# Altium schematic sheet Headers.SchDoc: Headers
size A3; DrawnBy: Hassan Alhujhoj, Abdullah Naeem; Address1: ECE Department; Address2: University of Canterbury; Address3: Christchurch 8041; Address4: New Zealand
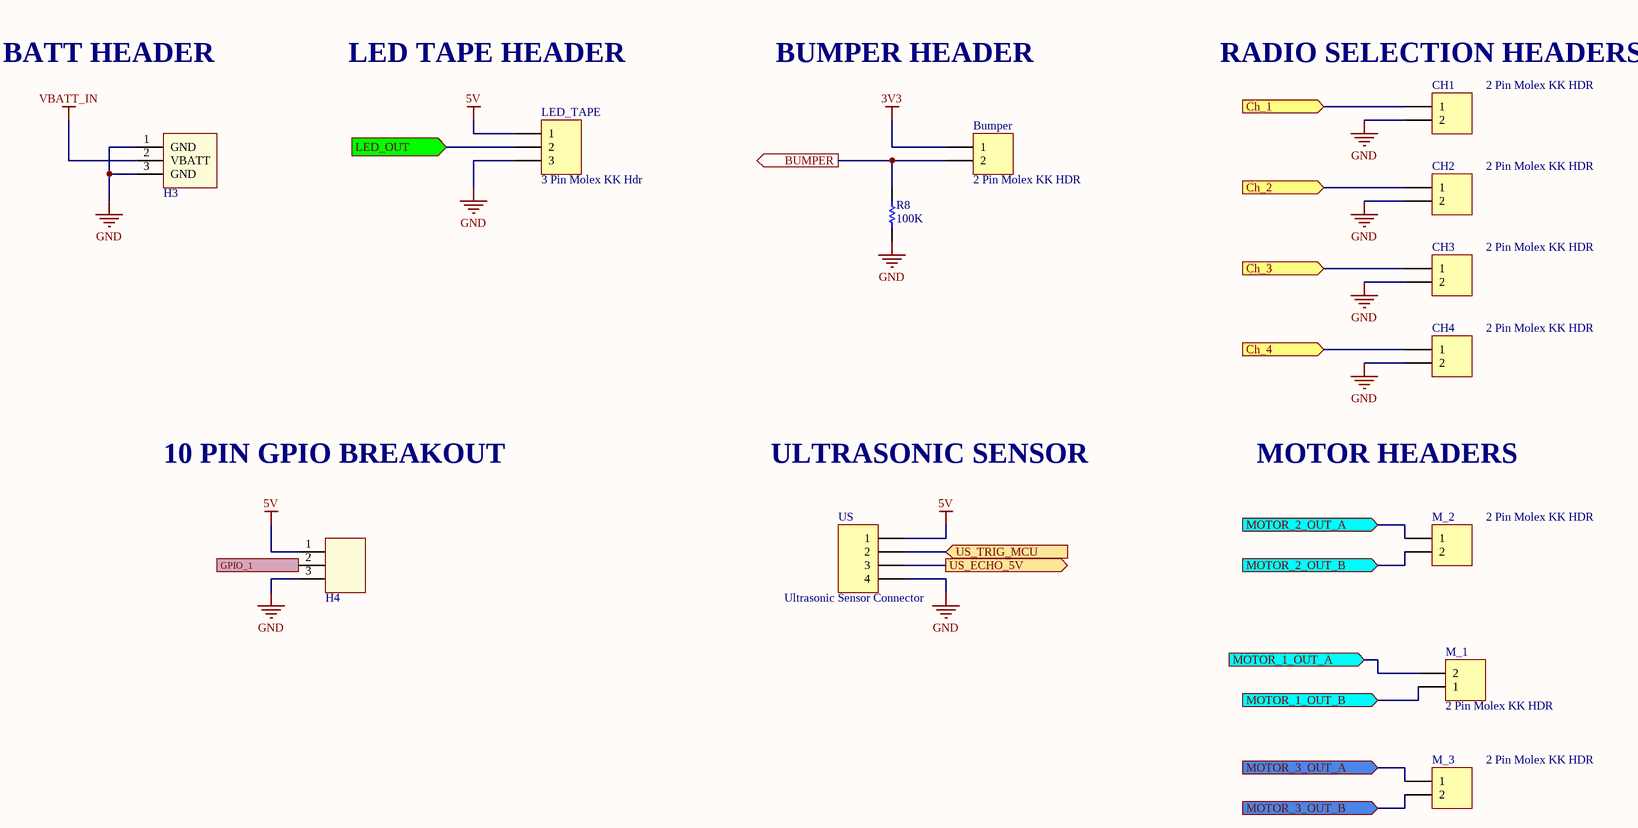
[diagram p0: Headers.SchDoc]

## Parts
Bumper  2 Pin Molex KK HDR  [MOLEX_KK_2_HDR]
CH1  2 Pin Molex KK HDR  [MOLEX_KK_2_HDR]
CH2  2 Pin Molex KK HDR  [MOLEX_KK_2_HDR]
CH3  2 Pin Molex KK HDR  [MOLEX_KK_2_HDR]
CH4  2 Pin Molex KK HDR  [MOLEX_KK_2_HDR]
H3  Battery_HEADER_3pin  [BATT_HEADER_3POS]  (value not drawn)
H4  HEADER_3  [HEADER_3POS]  (value not drawn)
LED_TAPE  3 Pin Molex KK Hdr  [MOLEX_KK_3_HDR]
M_1  2 Pin Molex KK HDR  [MOLEX_KK_2_HDR]
M_2  2 Pin Molex KK HDR  [MOLEX_KK_2_HDR]
M_3  2 Pin Molex KK HDR  [MOLEX_KK_2_HDR]
R8  100K  [RESC1608L]
US  Ultrasonic Sensor Connector  [MOLEX_KK_4_HDR]

## Ports
BUMPER (out), Ch_1 (in), Ch_2 (in), Ch_3 (in), Ch_4 (in), GPIO_1, LED_OUT (in), MOTOR_1_OUT_A (in), MOTOR_1_OUT_B (in), MOTOR_2_OUT_A (in), MOTOR_2_OUT_B (in), MOTOR_3_OUT_A (in), MOTOR_3_OUT_B (in), US_ECHO_5V (out), US_TRIG_MCU (in)

## Nets
3V3: Bumper.1
5V: H4.1 LED_TAPE.1 US.1
GND: CH1.2 CH2.2 CH3.2 CH4.2 H3.1(GND) H3.3(GND) H4.3 LED_TAPE.3 R8.1 US.4
VBATT_IN: H3.2(VBATT)
BUMPER: Bumper.2 R8.2 ; port BUMPER
Ch_1: CH1.1 ; port Ch_1
Ch_2: CH2.1 ; port Ch_2
Ch_3: CH3.1 ; port Ch_3
Ch_4: CH4.1 ; port Ch_4
GPIO_1: H4.2 ; port GPIO_1
LED_OUT: LED_TAPE.2 ; port LED_OUT
MOTOR_1_OUT_A: M_1.2 ; port MOTOR_1_OUT_A
MOTOR_1_OUT_B: M_1.1 ; port MOTOR_1_OUT_B
MOTOR_2_OUT_A: M_2.1 ; port MOTOR_2_OUT_A
MOTOR_2_OUT_B: M_2.2 ; port MOTOR_2_OUT_B
MOTOR_3_OUT_A: M_3.1 ; port MOTOR_3_OUT_A
MOTOR_3_OUT_B: M_3.2 ; port MOTOR_3_OUT_B
US_ECHO_5V: US.3 ; port US_ECHO_5V
US_TRIG_MCU: US.2 ; port US_TRIG_MCU

## Notes on the sheet
- BATT HEADER
- LED TAPE HEADER
- BUMPER HEADER
- (near CH1) RADIO SELECTION HEADERS
- 10 PIN GPIO BREAKOUT
- ULTRASONIC SENSOR
- MOTOR HEADERS
- Title
- Drawn by:
- Date:
- Time:
- Revision:
- Sheet
- of
- File:

## Library data of the parts
Bumper CH1-CH4 M_1-M_3 = JA_MOLEX_KK_2POS: CONN HEADER 2POS 2.54mm VERT_Thru Hole; Supplier 1: Farnell; Supplier Part Number 1: 1462926; Supplier: ECE Dept; Storage Location: ECE Dept Store; Value: 2 Pin Molex KK HDR
H3 = Battery_HEADER_3pin: 3Pin Header 2.54mm spacing
H4 = HEADER_3: 3Pin Header 2.54mm spacing
LED_TAPE = JA_MOLEX_KK_3POS: CONN HEADER 3POS 2.54mm VERT_Thru Hole; Manufacturer: Molex; Manufacturer PN: 22-23-2031; Supplier Part Number 1: 9731156; Supplier: ECE Dept; Supplier 1: Farnell; Storage Location: ECE Dept Store; Value: 3 Pin Molex KK Hdr
R8 = RS_100K: RES 100K OHM 1/10W 5% 0603 SMD; Storage Location: PCB Assembly WS; Supplier: ECE Dept; Value: 100K
US = JA_MOLEX_KK_4POS: CONN HEADER 4POS 2.54mm VERT_Thru Hole; Manufacturer: Molex; Manufacturer PN: 22-23-2041; Supplier Part Number 1: 9731164; Supplier: ECE Dept; Supplier 1: Farnell; Storage Location: ECE Dept Store; Value: Ultrasonic Sensor Connector